# EAGLE design DenScript Arduino Shield V1.0 (EAGLE 9.3.0)
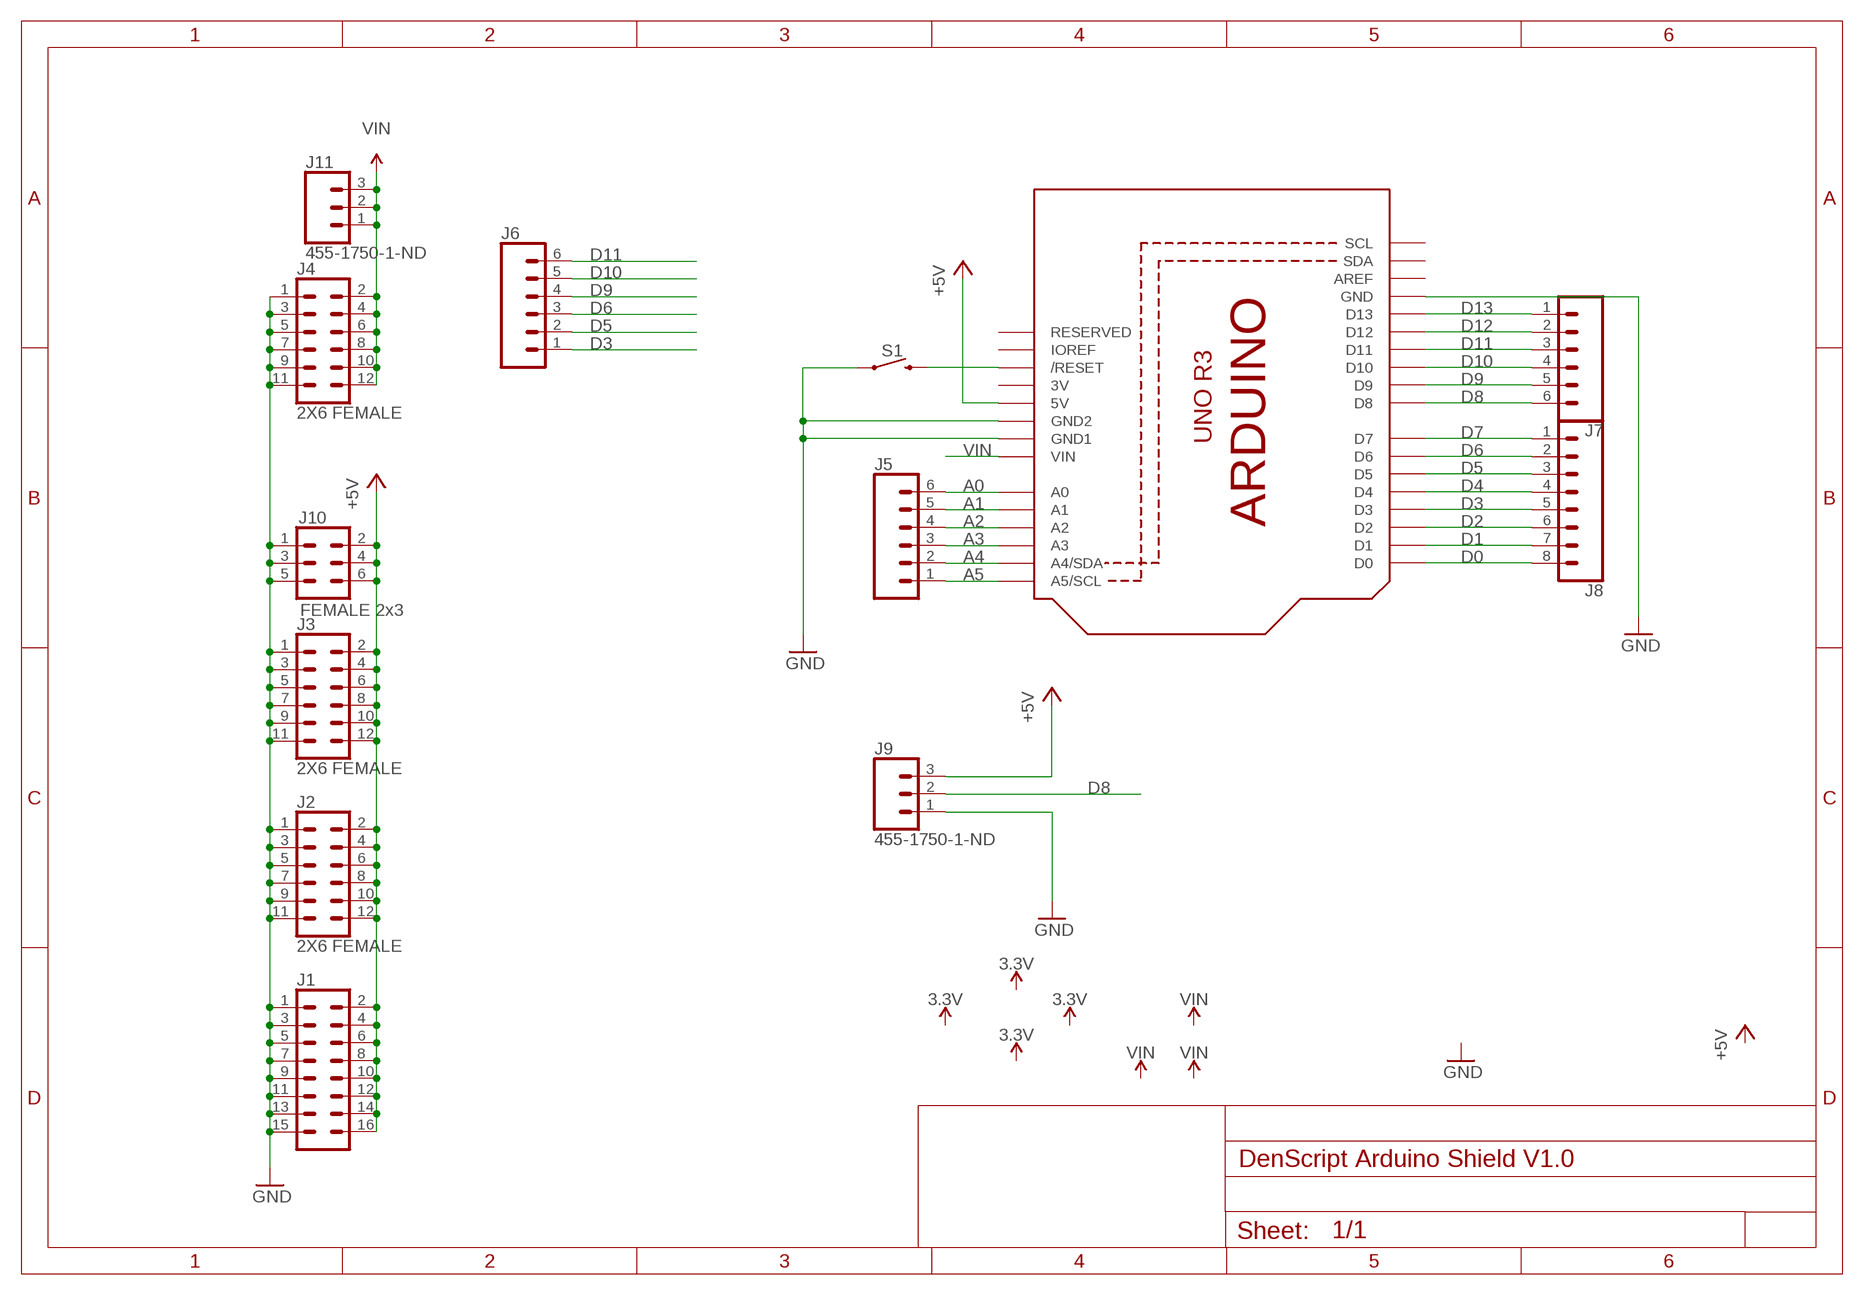
[diagram p0: schematic, sheet 1]

## Parts
J1  CONN_08X2_HEADER  [2X8]
J2  2X6 FEMALE  CONN_06X2PTH_FEMALE  [2X6]
J3  2X6 FEMALE  CONN_06X2PTH_FEMALE  [2X6]
J4  2X6 FEMALE  CONN_06X2PTH_FEMALE  [2X6]
J5  CONN_06SILK_FEMALE_PTH  [1X06]
J6  CONN_06SILK_FEMALE_PTH  [1X06]
J7  CONN_06SILK_FEMALE_PTH  [1X06]
J8  CONN_08"  [1X08]
J9  455-1750-1-ND  CONN_03  [1X03]
J10  FEMALE 2x3  CONN_03X2FEMALE  [2X3]
J11  455-1750-1-ND  CONN_03  [1X03]
S1  MOMENTARY-SWITCH-SPST-PTH-6.0MM  [TACTILE_SWITCH_PTH_6.0MM]
U1  ARDUINOR3-BPLACE  [ARDUINOR3-BPLACE]

## Nets
+5V: J1.2 J1.4 J1.6 J1.8 J1.10 J1.12 J1.14 J1.16 J2.2 J2.4 J2.6 J2.8 J2.10 J2.12 J3.2 J3.4 J3.6 J3.8 J3.10 J3.12 J9.3 J10.2 J10.4 J10.6 U1.5V
A0: J5.6 U1.A0
A1: J5.5 U1.A1
A2: J5.4 U1.A2
A3: J5.3 U1.A3
A4: J5.2 U1.A4(A4/SDA)
A5: J5.1 U1.A5(A5/SCL)
D0: J8.8 U1.D0
D1: J8.7 U1.D1
D2: J8.6 U1.D2
D3: J6.1 J8.5 U1.D3
D4: J8.4 U1.D4
D5: J6.2 J8.3 U1.D5
D6: J6.3 J8.2 U1.D6
D7: J8.1 U1.D7
D8: J7.6 J9.2 U1.D8
D9: J6.4 J7.5 U1.D9
D10: J6.5 J7.4 U1.D10
D11: J6.6 J7.3 U1.D11
D12: J7.2 U1.D12
D13: J7.1 U1.D13
GND: J1.1 J1.3 J1.5 J1.7 J1.9 J1.11 J1.13 J1.15 J2.1 J2.3 J2.5 J2.7 J2.9 J2.11 J3.1 J3.3 J3.5 J3.7 J3.9 J3.11 J4.1 J4.3 J4.5 J4.7 J4.9 J4.11 J9.1 J10.1 J10.3 J10.5 S1.1 U1.GND U1.GND1 U1.GND2
N$1: S1.3 U1.RESET(/RESET)
VIN: J4.2 J4.4 J4.6 J4.8 J4.10 J4.12 J11.1 J11.2 J11.3 U1.VIN
Unconnected: U1.AREF U1.IOREF U1.RESERVED U1.SCL U1.SDA

## Power pins joined to a net without a drawn wire
3V: U1.3V

## Library data of the parts
J1 = SparkFun-Connectors:CONN_08X2: Multi connection point. Often used as Generic Header-pin footprint for 0.1 inch spaced/style header connections You can populate with any combo of single row headers, but if you'd like an exact match, check this: Header - 2x8 (Male, 0.1") <https://www.sparkfun.com/products/13156> (PRT-13156) On any of the 0.1 inch spaced packages, you can populate with these: Break Away Headers - Straight <https://www.sparkfun.com/products/116> (PRT-00116) Break Away Male Headers - Right Angle <https://www.sparkfun.com/products/553> (PRT-00553) Female Headers <https://www.sparkfun.com/products/115> (PRT-00115) Break Away Headers - Machine Pin <https://www.sparkfun.com/products/117> (PRT-00117) Break Away Female Headers - Swiss Machine Pin <https://www.sparkfun.com/products/743> (PRT-00743)
J2-J4 = SparkFun-Connectors:CONN_06X2: Multi connection point. Often used as Generic Header-pin footprint for 0.1 inch spaced/style header connections On any of the 0.1 inch spaced packages, you can populate with these: Break Away Headers - Straight <https://www.sparkfun.com/products/116> (PRT-00116) Break Away Male Headers - Right Angle <https://www.sparkfun.com/products/553> (PRT-00553) Female Headers <https://www.sparkfun.com/products/115> (PRT-00115) Break Away Headers - Machine Pin <https://www.sparkfun.com/products/117> (PRT-00117) Break Away Female Headers - Swiss Machine Pin <https://www.sparkfun.com/products/743> (PRT-00743); PROD_ID: CONN-12423
J5-J7 = SparkFun-Connectors:CONN_06: Multi connection point. Often used as Generic Header-pin footprint for 0.1 inch spaced/style header connections On any of the 0.1 inch spaced packages, you can populate with these: Break Away Headers - Straight <https://www.sparkfun.com/products/116> (PRT-00116) Break Away Male Headers - Right Angle <https://www.sparkfun.com/products/553> (PRT-00553) Female Headers <https://www.sparkfun.com/products/115> (PRT-00115) Break Away Headers - Machine Pin <https://www.sparkfun.com/products/117> (PRT-00117) Break Away Female Headers - Swiss Machine Pin <https://www.sparkfun.com/products/743> (PRT-00743) Arduino Stackable Header - 6 Pin <https://www.sparkfun.com/products/9280> (PRT-09280) For SCREWTERMINALS and SPRING TERMINALS visit here: Screw Terimnals on SparkFun.com <https://www.sparkfun.com/search/results?term=Screw+Terminals> (5mm/3.5mm/2.54mm spacing) This device is also useful as a general connection point to wire up your design to another part of your project. Our various solder wires solder well into these plated through hole pads. Hook-Up Wire - Assortment (Stranded, 22 AWG) <https://www.sparkfun.com/products/11375> (PRT-11375) Hook-Up Wire - Assortment (Solid Core, 22 AWG) <https://www.sparkfun.com/products/11367> (PRT-11367) View the entire wire category on our website here <https://www.sparkfun.com/categories/141>; PROD_ID: CONN-08437
J8 = SparkFun-Connectors:CONN_08: Multi connection point. Often used as Generic Header-pin footprint for 0.1 inch spaced/style header connections On any of the 0.1 inch spaced packages, you can populate with these: Break Away Headers - Straight <https://www.sparkfun.com/products/116> (PRT-00116) Break Away Male Headers - Right Angle <https://www.sparkfun.com/products/553> (PRT-00553) Female Headers <https://www.sparkfun.com/products/115> (PRT-00115) Break Away Headers - Machine Pin <https://www.sparkfun.com/products/117> (PRT-00117) Break Away Female Headers - Swiss Machine Pin <https://www.sparkfun.com/products/743> (PRT-00743) Arduino Stackable Header - 8 Pin <https://www.sparkfun.com/products/9279> (PRT-09279) For SCREWTERMINALS and SPRING TERMINALS visit here: Screw Terimnals on SparkFun.com <https://www.sparkfun.com/search/results?term=Screw+Terminals> (5mm/3.5mm/2.54mm spacing) This device is also useful as a general connection point to wire up your design to another part of your project. Our various solder wires solder well into these plated through hole pads. Hook-Up Wire - Assortment (Stranded, 22 AWG) <https://www.sparkfun.com/products/11375> (PRT-11375) Hook-Up Wire - Assortment (Solid Core, 22 AWG) <https://www.sparkfun.com/products/11367> (PRT-11367) View the entire wire category on our website here <https://www.sparkfun.com/categories/141> Special notes: Molex polarized connector foot print use with SKU : PRT-08231 with associated crimp pins and housings. 1MM SMD Version SKU: PRT-10208 NOTES ON THE VARIANTS LOCK and LOCK_LONGPADS... This footprint was designed to help hold the alignment of a through-hole component (i.e. 6-pin header) while soldering it into place. You may notice that each hole has been shifted either up or down by 0.005 of an inch from it's more standard position (which is a perfectly straight line). This slight alteration caused the pins (the squares in the middle) to touch the edges of the holes. Because they are alternating, it causes a "brace" to hold the component in place. 0.005 has proven to be the perfect amount of "off-center" position when using our standard breakaway headers. Although looks a little odd when you look at the bare footprint, once you have a header in there, the alteration is very hard to notice. Also,if you push a header all the way into place, it is covered up entirely on the bottom side.; PROD_ID: CONN-08438
J9 J11 = SparkFun-Connectors:CONN_03: Multi connection point. Often used as Generic Header-pin footprint for 0.1 inch spaced/style header connections On any of the 0.1 inch spaced packages, you can populate with these: Break Away Headers - Straight <https://www.sparkfun.com/products/116> (PRT-00116) Break Away Male Headers - Right Angle <https://www.sparkfun.com/products/553> (PRT-00553) Female Headers <https://www.sparkfun.com/products/115> (PRT-00115) Break Away Headers - Machine Pin <https://www.sparkfun.com/products/117> (PRT-00117) Break Away Female Headers - Swiss Machine Pin <https://www.sparkfun.com/products/743> (PRT-00743) Stackable Header - 3 Pin (Female, 0.1") <https://www.sparkfun.com/products/13875> (PRT-13875) For SCREWTERMINALS and SPRING TERMINALS visit here: Screw Terimnals on SparkFun.com <https://www.sparkfun.com/search/results?term=Screw+Terminals> (5mm/3.5mm/2.54mm spacing) This device is also useful as a general connection point to wire up your design to another part of your project. Our various solder wires solder well into these plated through hole pads. Hook-Up Wire - Assortment (Stranded, 22 AWG) <https://www.sparkfun.com/products/11375> (PRT-11375) Hook-Up Wire - Assortment (Solid Core, 22 AWG) <https://www.sparkfun.com/products/11367> (PRT-11367) View the entire wire category on our website here <https://www.sparkfun.com/categories/141> Special notes: Molex polarized connector foot print use with SKU : PRT-08232 with associated crimp pins and housings.; PROD_ID: XXX-00000
J10 = SparkFun-Connectors:CONN_03X2: Multi connection point. Often used as Generic Header-pin footprint for 0.1 inch spaced/style header connections You can populate with any combo of single row headers, but if you'd like an exact match, check these: Header - 2x3 (Male, 0.1") <https://www.sparkfun.com/products/12807> (PRT-12807) Header - 2x3 (Female, 0.1") <https://www.sparkfun.com/products/13010> (PRT-13010) 2x3 Pin Shrouded Header <https://www.sparkfun.com/products/10877> (PRT-10877) On any of the 0.1 inch spaced packages, you can populate with these: Break Away Headers - Straight <https://www.sparkfun.com/products/116> (PRT-00116) Break Away Male Headers - Right Angle <https://www.sparkfun.com/products/553> (PRT-00553) Female Headers <https://www.sparkfun.com/products/115> (PRT-00115) Break Away Headers - Machine Pin <https://www.sparkfun.com/products/117> (PRT-00117) Break Away Female Headers - Swiss Machine Pin <https://www.sparkfun.com/products/743> (PRT-00743) Special note: the shrouded connector mates well with our 3x2 ribbon cables: Ribbon Crimp Connector - 6-pin (2x3, Female) <https://www.sparkfun.com/products/10651> (PRT-10651) Ribbon Cable - 6 wire (15ft) <https://www.sparkfun.com/products/10646> (PRT-10646); PROD_ID: CONN-11566
S1 = SparkFun-Switches:MOMENTARY-SWITCH-SPST: Momentary Switch (Pushbutton) - SPST Normally-open (NO) SPST momentary switches (buttons, pushbuttons). Variants PTH-12MM - 12mm square, through-hole Momentary Pushbutton Switch - 12mm Square <https://www.sparkfun.com/products/9190> (COM-09190) PTH-6.0MM, PTH-6.0MM-KIT - 6.0mm square, through-hole Mini Pushbutton Switch <https://www.sparkfun.com/products/97> (COM-00097) KIT package intended for soldering kit's - only one side of pads' copper is exposed. PTH-RIGHT-ANGLE-KIT - Right-angle, through-hole Right Angle Tactile Button <https://www.sparkfun.com/products/10791> - Used on SparkFun BigTime Watch Kit <https://www.sparkfun.com/products/11734> SMD-12MM - 12mm square, surface-mount Tactile Button - SMD (12mm) <https://www.sparkfun.com/products/12993> (COM-12993) Used on SparkFun PicoBoard <https://www.sparkfun.com/products/11888> SMD-4.5MM - 4.5mm Square Trackball Switch Used on SparkFun Blackberry Trackballer Breakout <https://www.sparkfun.com/products/13169> SMD-4.6MMX2.8MM - 4.60mm x 2.80mm, surface mount Used on SparkFun SAMD21 Mini Breakout <https://www.sparkfun.com/products/13664> SMD-5.2MM, SMD-5.2-REDUNDANT - 5.2mm square, surface-mount Mini Pushbutton Switch - SMD <https://www.sparkfun.com/products/8720> (COM-08720) Used on Arduino Pro Mini <https://www.sparkfun.com/products/11114> REDUNDANT package connects both switch circuits together SMD-6.0X3.5MM - 6.0 x 3.5mm, surface mount Momentary Reset Switch SMD <https://www.sparkfun.com/products/8229> (COM-08229) SMD-6.2MM-TALL - 6.2mm square, surface mount Tactile Button - SMD (6mm) <https://www.sparkfun.com/products/12992> Used on SparkFun Digital Sandbox <https://www.sparkfun.com/products/12651> SMD-RIGHT-ANGLE - Right-angle, surface mount Used on SparkFun Block for Intel® Edison - Arduino <https://www.sparkfun.com/products/13036>; PROD_ID: SWCH-08441; SF_SKU: COM-00097
U1 = adafruit:ARDUINOR3: This is a new object for the new Arduino R3 - with extra pins that you may want to use (such as IOref, and duplicated A4/A5

## Board
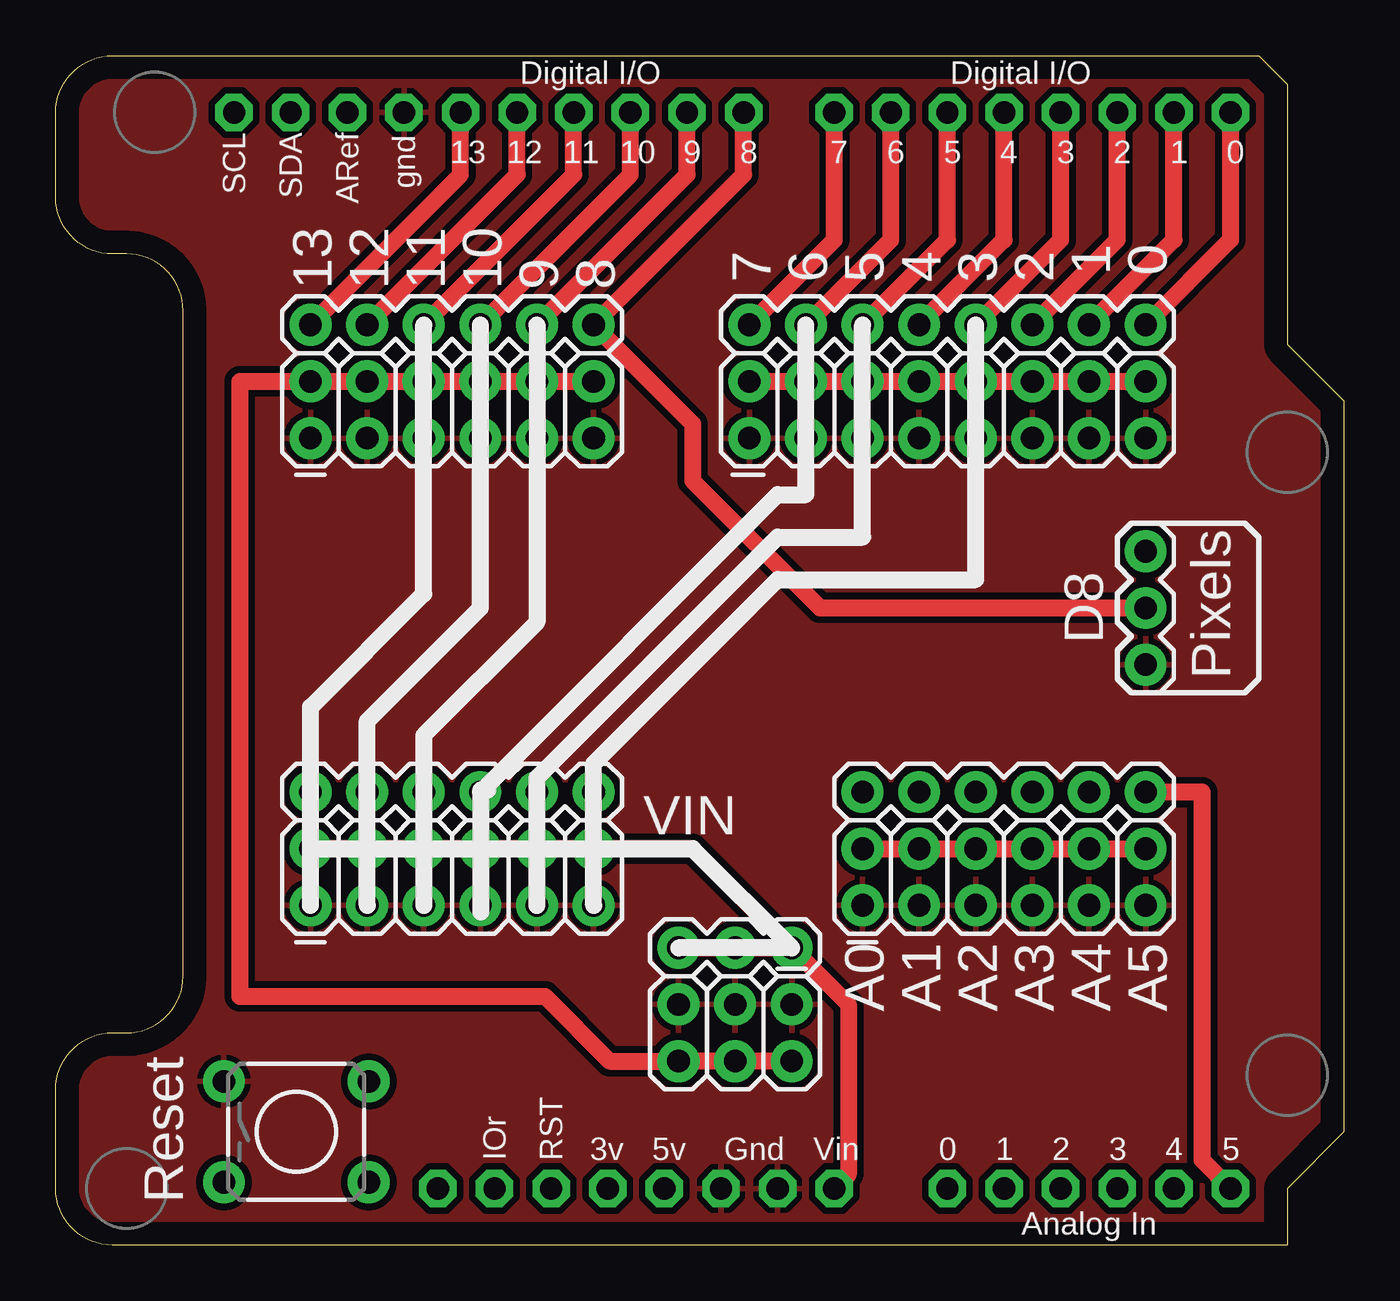
[diagram p1: board, top side]
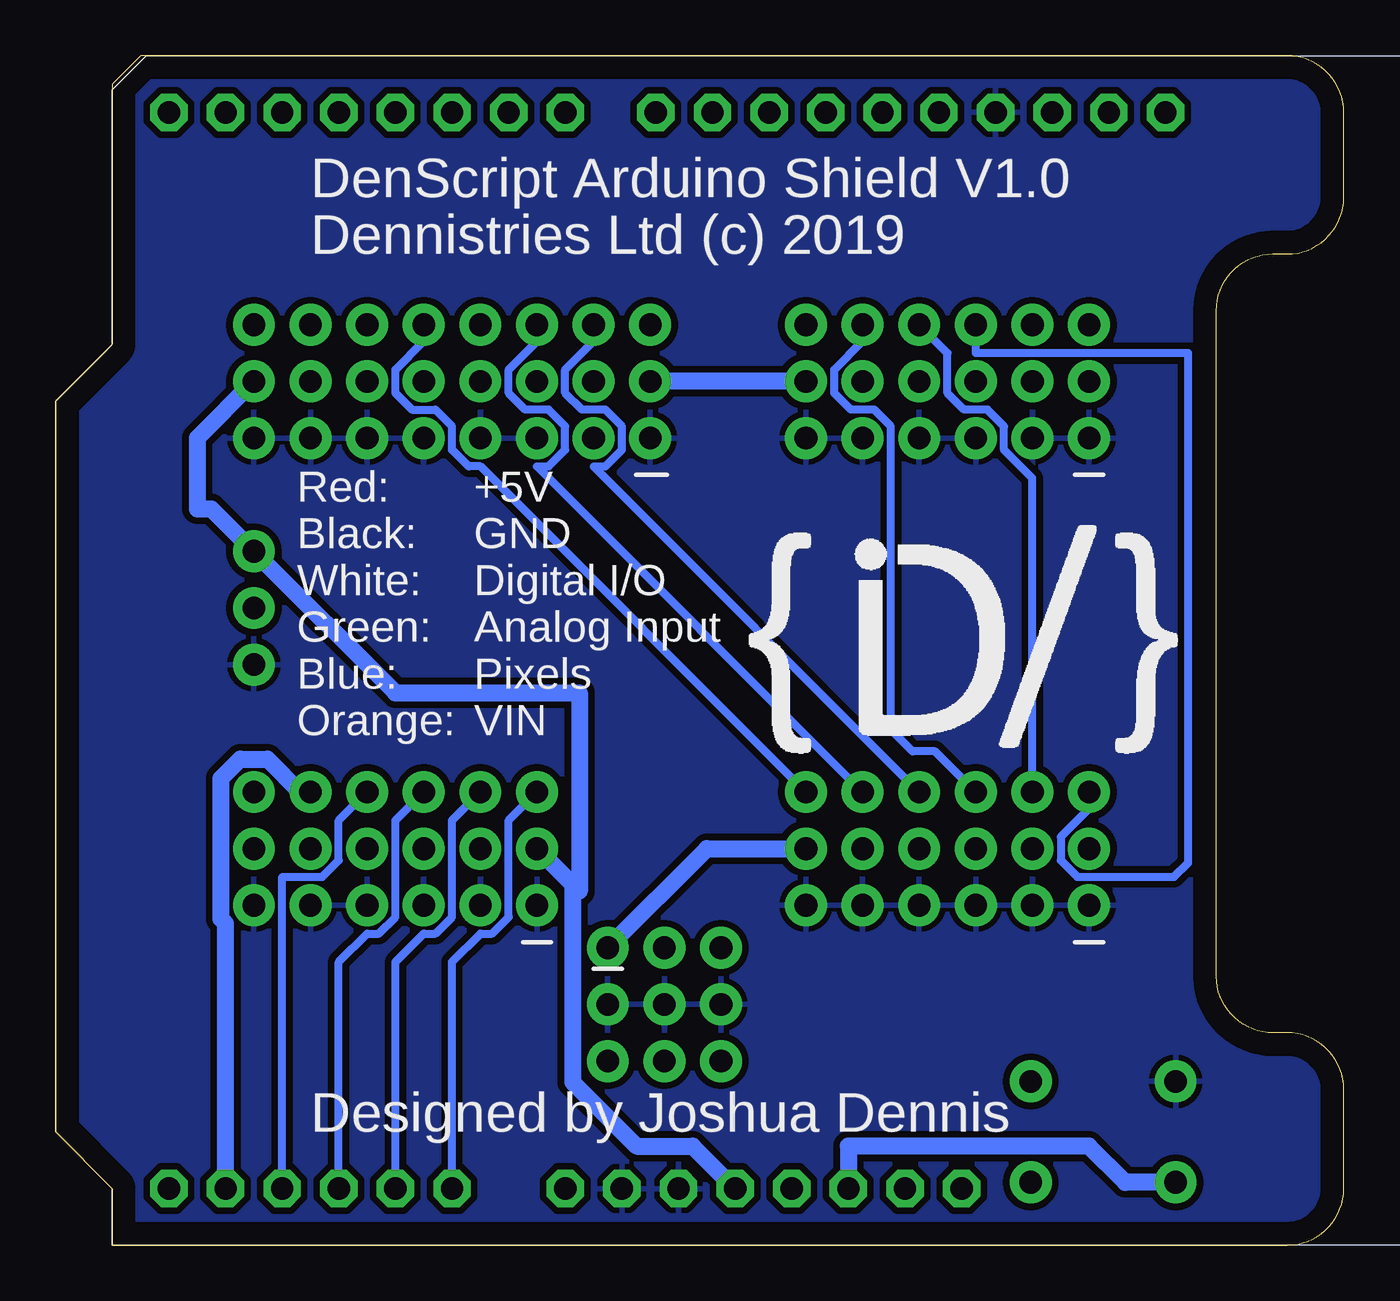
[diagram p2: board, bottom side, seen from below]

Size 57.78 x 53.34 mm. Coordinates in mm from the lower left corner, seen from the top.
Outline: 55.25,0 2.54,0 arc-90 0,2.54 0,6.99 arc-90 2.54,9.53 3.18,9.53 arc90 5.72,12.06 5.72,41.91 arc90 3.18,44.45 2.54,44.45 arc-90 0,46.99 0,50.8 arc-90 2.54,53.34 53.97,53.34 55.25,52.07 55.25,40.41 57.78,37.87 57.78,5.08 55.25,2.54 55.25,0
Copper layers (1*16): Top 0.035mm / dielectric 1.5mm / Bottom 0.035mm
Design rules "default": minimum track width 6mil, minimum drill 0.35mm, track to track 6mil, track to pad 6mil, pad to pad 6mil, via to via 6mil, smd to smd 6mil, copper to edge 40mil, drill to drill 6mil, minimum pad ring 10mil, minimum via ring 8mil, stop-mask expansion 4mil, vias tented up to drill 0mil, thermal gap 10mil

### Footprints (pad centres in the part's own frame; a part is rotated, then mirrored left to right if it is on the bottom)
2X8 = drill 1.016 pad 1.88: 1 0,0; 2 0,2.54; 3 2.54,0; 4 2.54,2.54; 5 5.08,0; 6 5.08,2.54; 7 7.62,0; 8 7.62,2.54; 9 10.16,0; 10 10.16,2.54; 11 12.7,0; 12 12.7,2.54; 13 15.24,0; 14 15.24,2.54; 15 17.78,0; 16 17.78,2.54
2X6 = drill 1.016 pad 1.88: 1 0,0; 2 0,2.54; 3 2.54,0; 4 2.54,2.54; 5 5.08,0; 6 5.08,2.54; 7 7.62,0; 8 7.62,2.54; 9 10.16,0; 10 10.16,2.54; 11 12.7,0; 12 12.7,2.54
1X06 = drill 1.016 pad 1.88: 1 0,0; 2 2.54,0; 3 5.08,0; 4 7.62,0; 5 10.16,0; 6 12.7,0
1X08 = drill 1.016 pad 1.88: 1 0,0; 2 2.54,0; 3 5.08,0; 4 7.62,0; 5 10.16,0; 6 12.7,0; 7 15.24,0; 8 17.78,0
1X03 = drill 1.016 pad 1.88: 1 0,0; 2 2.54,0; 3 5.08,0
2X3 = drill 1.016 pad 1.88: 1 0,0; 2 0,2.54; 3 2.54,0; 4 2.54,2.54; 5 5.08,0; 6 5.08,2.54
TACTILE_SWITCH_PTH_6.0MM = drill 1.016 pad 1.88: 1 -3.251,2.261; 2 3.251,2.261; 3 -3.251,-2.261; 4 3.251,-2.261
ARDUINOR3-BPLACE = drill 1 pad 1.676 octagon: 3V 35.56,2.54; 5V 38.1,2.54; A0 50.8,2.54; A1 53.34,2.54; A2 55.88,2.54; A3 58.42,2.54; A4 60.96,2.54; A5 63.5,2.54; AREF 23.876,50.8; D0 63.5,50.8; D1 60.96,50.8; D2 58.42,50.8; D3 55.88,50.8; D4 53.34,50.8; D5 50.8,50.8; D6 48.26,50.8; D7 45.72,50.8; D8 41.656,50.8; D9 39.116,50.8; D10 36.576,50.8; D11 34.036,50.8; D12 31.496,50.8; D13 28.956,50.8; GND 26.416,50.8; GND1 43.18,2.54; GND2 40.64,2.54; IOREF 30.48,2.54; RESERVED 27.94,2.54; RESET 33.02,2.54; SCL 18.796,50.8; SDA 21.336,50.8; VIN 45.72,2.54

### Placement (x,y rotation side)
J1  31.11,36.2 0 top
J2  11.43,36.2 0 top
J3  36.2,15.24 0 top
J4  11.43,15.24 0 top
J5  48.89,20.32 180 top
J6  24.13,20.32 180 top
J7  11.43,41.27 0 top
J8  31.11,41.27 0 top
J9  48.89,26.04 90 top
J10  33.02,10.79 180 top
J11  27.94,13.34 0 top
S1  10.79,5.08 0 top
U1  -10.79,0 0 top

### Tracks (layer width: path | path; a pad name or v marks a point on that pad's centre or on a via)
+5V
  Top 0.762: J3.2 J3.4 J3.6 J3.8 J3.10 J3.12 | J1.2 J1.4 J1.6 J1.8 J1.10 J1.12 J1.14 J1.16 | J2.12 J2.10 J2.8 J2.6 J2.4 J2.2 8.26,38.73 8.26,11.15 21.95,11.15 24.85,8.26 J10.6 J10.4 J10.2
  Bottom 0.762: U1.5V 29.21,4.45 31.73,4.45 34.59,7.32 34.59,16.18 | 34.59,16.18 34.29,15.88 34.29,24.77 42.55,24.77 J9.3 50.8,33.02 51.43,33.02 51.43,36.2 J1.16 | 34.59,16.18 J3.2 | J2.12 J1.2
A0
  Bottom 0.356: U1.A0 40,12.7 38.73,13.97 38.21,13.97 37.46,14.71 37.46,19.05 J5.6
A1
  Bottom 0.356: U1.A1 42.55,12.7 41.27,13.97 40.75,13.97 40,14.71 40,19.05 J5.5
A2
  Bottom 0.356: U1.A2 45.09,12.7 43.81,13.97 43.29,13.97 42.55,14.71 42.55,19.05 J5.4
A3
  Bottom 0.356: U1.A3 47.62,16.51 45.83,16.51 45.09,17.25 45.09,19.05 J5.3
A4
  Bottom 0.762: U1.A4 50.16,14.43 50.37,14.63 50.37,20.93 49.5,21.79 48.28,21.79 46.81,20.32 J5.2
A5
  Top 0.762: U1.A5 51.43,3.81 51.43,20.32 J5.1
D0
  Top 0.762: U1.D0 52.7,45.09 J8.8
D1
  Top 0.762: J8.7 50.16,45.09 U1.D1
D2
  Top 0.762: J8.6 47.62,45.09 U1.D2
D3
  Top 0.762: J8.5 45.09,45.09 U1.D3
  Bottom 0.356: J6.1 38.73,34.92 39.26,34.92 40,35.67 40,36.72 40.75,37.47 41.8,37.47 42.55,38.21 42.55,39.26 41.27,40.53 J8.5
D4
  Top 0.762: J8.4 42.55,45.09 U1.D4
D5
  Top 0.762: J8.3 40,45.09 U1.D5
  Bottom 0.356: J6.2 36.2,34.92 35.67,34.92 34.92,35.67 34.92,36.72 35.67,37.47 36.72,37.47 37.46,38.21 37.46,39.26 36.2,40.53 J8.3
D6
  Top 0.762: J8.2 37.46,45.09 U1.D6
  Bottom 0.356: J6.3 33.66,34.92 33.13,34.92 32.38,35.67 32.38,36.72 33.13,37.47 34.18,37.47 34.92,38.21 34.92,39.26 33.66,40.53 J8.2
D7
  Top 0.762: J8.1 34.92,45.09 U1.D7
D8
  Top 0.762: U1.D8 30.86,48.01 J7.6 28.57,36.83 28.57,34.29 34.29,28.57 J9.2
D9
  Top 0.762: J7.5 28.32,48.01 U1.D9
  Bottom 0.356: J6.4 18.34,22.15 19.34,22.15 20.32,23.12 20.32,36.72 21.06,37.47 22.12,37.47 22.86,38.21 22.86,39.26 21.59,40.53 J7.5
D10
  Top 0.762: J7.4 25.78,48.01 U1.D10
  Bottom 0.356: J6.5 13.97,34.4 15.24,35.67 15.24,36.72 15.98,37.47 17.04,37.47 17.78,38.21 17.78,40.01 J7.4
D11
  Top 0.762: J7.3 23.24,48.01 U1.D11
  Bottom 0.356: J6.6 11.43,19.58 12.7,18.31 12.7,17.25 11.96,16.51 7.62,16.51 6.99,17.14 6.99,40.01 16.51,40.01 J7.3
D12
  Top 0.762: J7.2 20.7,48.01 U1.D12
D13
  Top 0.762: J7.1 18.16,48.01 U1.D13
GND
  pour Bottom (isolate 0.305): -10.79,0 55.25,0 55.25,2.54 57.78,5.08 57.78,38.1 55.25,40.64 55.25,52.07 53.97,53.34 -10.79,53.34
  pour Top (isolate 0.305): -1.9,0 57.78,0 57.78,53.34 -1.9,53.34
N$1
  Bottom 0.762: S1.3 9.8,2.82 11.43,4.45 22.23,4.45 U1.RESET
VIN
  Top 0.762: J4.2 J4.4 J4.6 J4.8 J4.10 J4.12 28.57,17.78 35.56,10.79 35.56,3.17 U1.VIN | J11.1 J11.2 J11.3
  Bottom 0.762: J11.3 28.57,17.78 J4.12

### Text on the board
tPlace: 13 | 12 | 11 | 10 | 9 | 8 | 7 | 6 | 5 | 4 | 3 | 2 | 1 | 0 | D8 | Pixels | VIN | A0 | A1 | A2 | A3 | A4 | A5 | Reset
bPlace: DenScript Arduino Shield V1.0 | Dennistries Ltd (c) 2019 | +5V / GND / Digital I/O / Analog Input / Pixels / VIN | Red: / Black: / White: / Green: / Blue: / Orange: | Designed by Joshua Dennis